# Altium schematic sheet io-expander.SchDoc: Test
size A4; DrawnBy: Łukasz Przeniosło; Organization: Apptimia sp. z o.o.; Address1: Wojska Polskiego 184c/4; Address2: 71-256 Szczecin; Address3: www.apptimia.com; DocumentNumber: 12; Revision: 1; SheetNumber: 12; SheetTotal: 12
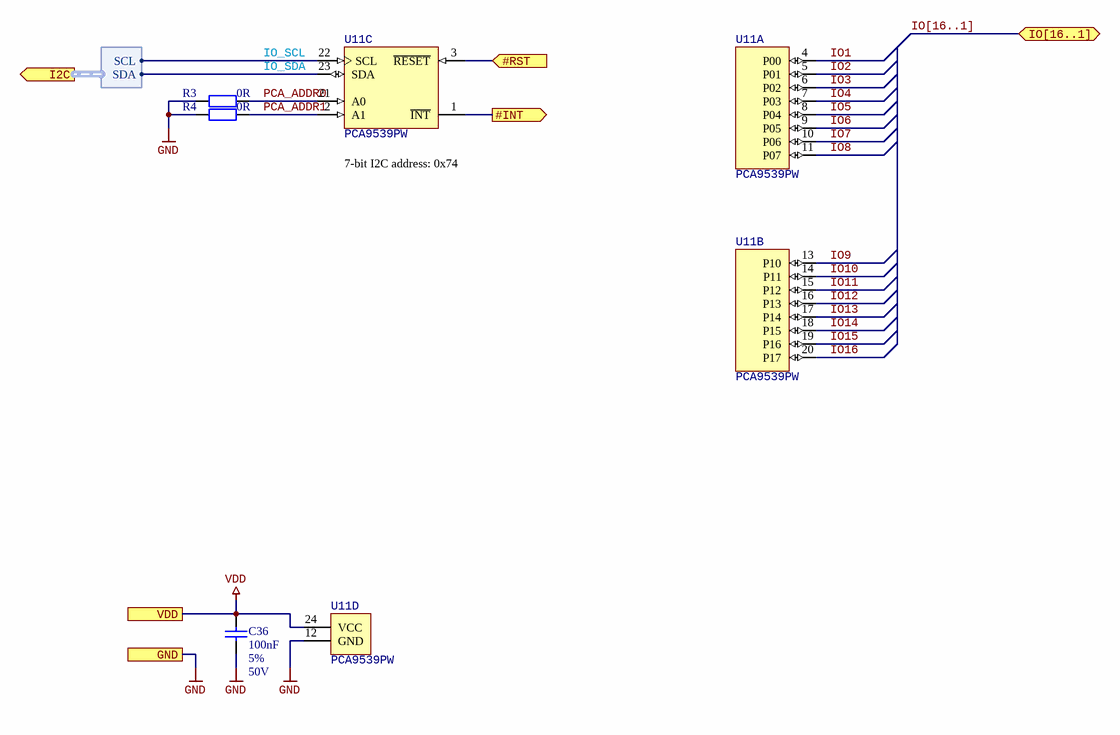
[diagram p0: io-expander.SchDoc]

## Parts
C36  100nF  Tolerance: 5%  Voltage: 50V  [CAPC1608N]
R3  0R  [RESC1005N]
R4  0R  [RESC1005N]
U11  PCA9539PW  [TSSOP24_L]  (parts A,B,C,D of 4)

## Ports
#INT (out), #RST (in), GND, I2C (out, harness I2C), IO[16..1] (bidir), VDD

## Harnesses
I2C: SCL, SDA

## Nets
GND: C36.1 R3.1 R4.1 U11.12(GND) ; port GND
VDD: C36.2 U11.24(VCC) ; port VDD
#INT: U11.1(~{INT}) ; port #INT
#RST: U11.3(~{RESET}) ; port #RST
IO1: U11.4(P00)
IO2: U11.5(P01)
IO3: U11.6(P02)
IO4: U11.7(P03)
IO5: U11.8(P04)
IO6: U11.9(P05)
IO7: U11.10(P06)
IO8: U11.11(P07)
IO9: U11.13(P10)
IO10: U11.14(P11)
IO11: U11.15(P12)
IO12: U11.16(P13)
IO13: U11.17(P14)
IO14: U11.18(P15)
IO15: U11.19(P16)
IO16: U11.20(P17)
IO_SCL: U11.22(SCL) ; port I2C.SCL
IO_SDA: U11.23(SDA) ; port I2C.SDA
PCA_ADDR0: R3.2 U11.21(A0)
PCA_ADDR1: R4.2 U11.2(A1)

## Buses and harness runs
bus IO[16..1] = port IO[16..1]

## Notes on the sheet
- (near U11) 7-bit I2C address: 0x74
- Title
- Size:
- Date:
- A4
- Author:
- Time:
- Sheet
- of
- File:

## Library data of the parts
C36 = Capacitor: Value: 100nF
R3 R4 = Resistor: Power: 0W1; Tolerance: 5%; Value: 0R
U11 = PCA9539: 16-bit I 2 C-bus and SMBus low power I/O port with interrupt and reset; manid: PCA9539PW